# EAGLE design cloud_humidity_sensor_v1 (EAGLE 6.4)
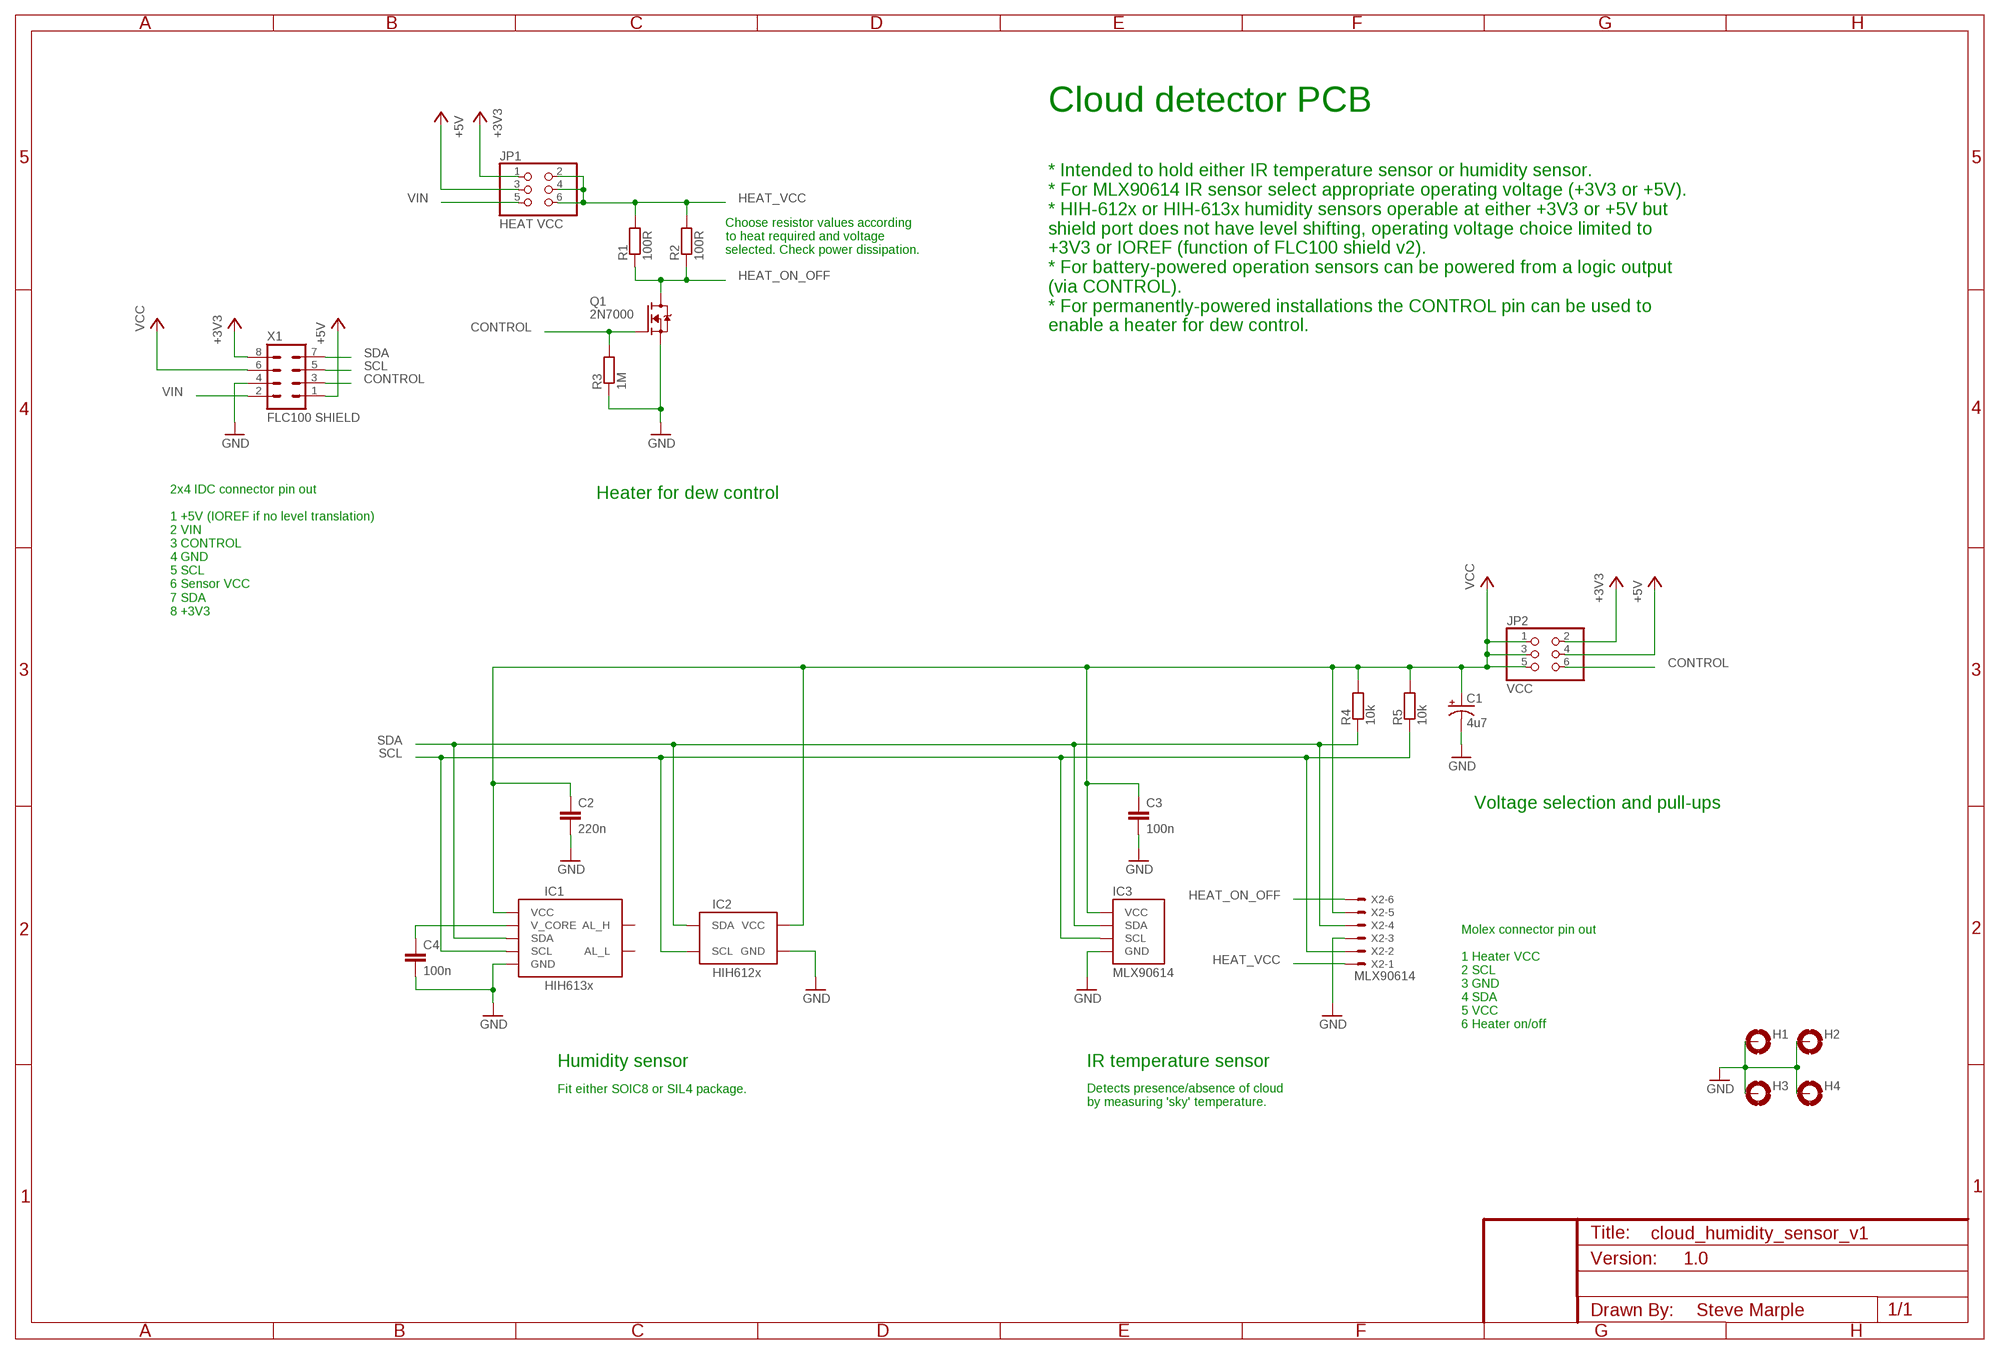
[diagram p0: schematic, sheet 1]
FRAME1 (FRAME-A3): VERSION: 1.0

## Parts
C1  4u7  CAP_POLPTH2  [CPOL-RADIAL-10UF-25V]
C2  220n  CAPPTH  [CAP-PTH-SMALL]
C3  100n  CAPPTH  [CAP-PTH-SMALL]
C4  100n  CAPPTH  [CAP-PTH-SMALL]
H1  MOUNT-PAD-ROUND3.0  [3,0-PAD]
H2  MOUNT-PAD-ROUND3.0  [3,0-PAD]
H3  MOUNT-PAD-ROUND3.0  [3,0-PAD]
H4  MOUNT-PAD-ROUND3.0  [3,0-PAD]
IC1  HIH613x  HONEYWELL-HIH613XSOIC8  [SO08]
IC2  HIH612x  HONEYWELL-HIH612X  [SIL04]
IC3  MLX90614  MLX90614TO-39  [TO39-4]
JP1  HEAT VCC  PINHD-2X3  [2X03]
JP2  VCC  PINHD-2X3  [2X03]
Q1  2N7000  [TO-92]
R1  100R  RESISTOR  [RES-AXIAL-0.4]
R2  100R  RESISTOR  [RES-AXIAL-0.4]
R3  1M  RESISTOR  [RES-AXIAL-0.4]
R4  10k  RESISTOR  [RES-AXIAL-0.4]
R5  10k  RESISTOR  [RES-AXIAL-0.4]
X1  FLC100 SHIELD  ML8  [ML8]
X2  MLX90614  22-23-2061  [22-23-2061]

## Nets
+3V3 [power]: JP1.1 JP2.2 X1.8
+5V [power]: JP1.3 JP2.4 X1.1
CONTROL: JP2.6 Q1.2(G) R3.P$2 X1.3
GND [power]: C1.2(-) C2.2 C3.2 C4.2 H1.B3,0(MOUNT) H2.B3,0(MOUNT) H3.B3,0(MOUNT) H4.B3,0(MOUNT) IC1.2(GND) IC2.2(GND) IC3.4(GND) Q1.1(S) R3.P$1 X1.4 X2.3
HEAT_ON_OFF [power]: Q1.3(D) R1.P$1 R2.P$1 X2.6
HEAT_VCC [power]: JP1.2 JP1.4 JP1.6 R1.P$2 R2.P$2 X2.1
SCL: IC1.3(SCL) IC2.3(SCL) IC3.1(SCL) R5.P$1 X1.5 X2.2
SDA: IC1.4(SDA) IC2.4(SDA) IC3.2(SDA) R4.P$1 X1.7 X2.4
V_CORE [power]: C4.1 IC1.1(V_CORE)
VCC [power]: C1.1(+) C2.1 C3.1 IC1.8(VCC) IC2.1(VCC) IC3.3(VCC) JP2.1 JP2.3 JP2.5 R4.P$2 R5.P$2 X1.6 X2.5
VIN [power]: JP1.5 X1.2
Unconnected: IC1.5(AL_H) IC1.6(AL_L)

## Notes on the sheet
- Cloud detector PCB
- * Intended to hold either IR temperature sensor or humidity sensor.
  * For MLX90614 IR sensor select appropriate operating voltage (+3V3 or +5V).
  * HIH-612x or HIH-613x humidity sensors operable at either +3V3 or +5V but
  shield port does not have level shifting, operating voltage choice limited to
  +3V3 or IOREF (function of FLC100 shield v2).
  * For battery-powered operation sensors can be powered from a logic output
  (via CONTROL).
  * For permanently-powered installations the CONTROL pin can be used to
  enable a heater for dew control.
- Choose resistor values according
  to heat required and voltage
  selected. Check power dissipation.
- Heater for dew control
- 2x4 IDC connector pin out
  
  1 +5V (IOREF if no level translation)
  2 VIN
  3 CONTROL
  4 GND
  5 SCL
  6 Sensor VCC
  7 SDA
  8 +3V3
- Voltage selection and pull-ups
- Molex connector pin out
  
  1 Heater VCC
  2 SCL
  3 GND
  4 SDA
  5 VCC
  6 Heater on/off
- Humidity sensor | IR temperature sensor
- Fit either SOIC8 or SIL4 package.
- Detects presence/absence of cloud
  by measuring 'sky' temperature.
- 1.0
- Steve Marple

## Library data of the parts
C1 = SteveMarple:CAP_POL: Capacitor Polarized These are standard SMD and PTH capacitors. Normally 10uF, 47uF, and 100uF in electrolytic and tantalum varieties. Always verify the external diameter of the through hole cap, it varies with capacity, voltage, and manufacturer. The EIA devices should be standard.
C2-C4 = SparkFun:CAP: Capacitor Standard 0603 ceramic capacitor, and 0.1" leaded capacitor.
H1-H4 = holes:MOUNT-PAD-ROUND: MOUNTING PAD, round
IC1 = SteveMarple:HONEYWELL-HIH613X
IC2 = SteveMarple:HONEYWELL-HIH612X
IC3 = SteveMarple:MLX90614
JP1 JP2 = pinhead:PINHD-2X3: PIN HEADER
Q1 = SteveMarple:2N7000: 2N7000 FET
R1-R5 = SteveMarple:RESISTOR: 1/4W PTH resistor
X1 = SteveMarple:ML8
X2 = con-molex:22-23-2061: .100" (2.54mm) Center Header - 6 Pin; MF: MOLEX; MPN: 22-23-2061; OC_FARNELL: 1462922; OC_NEWARK: 27C1933

## Net classes
1 power: width 0.381 mm

## Board
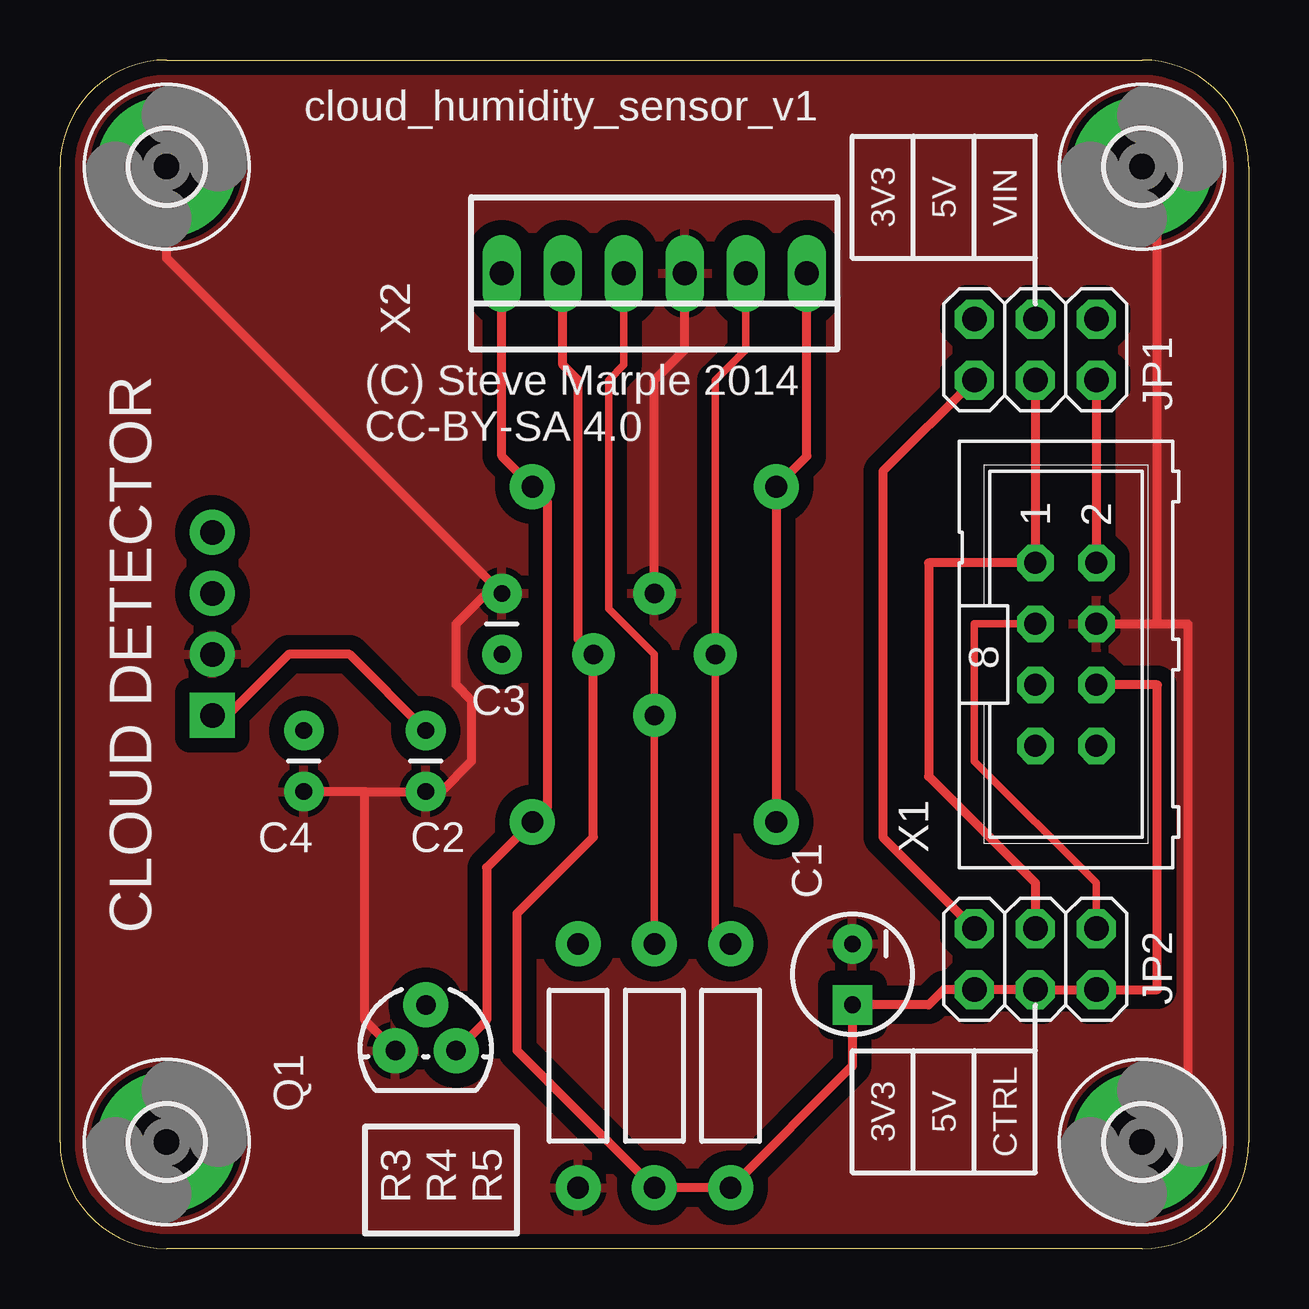
[diagram p1: board, top side]
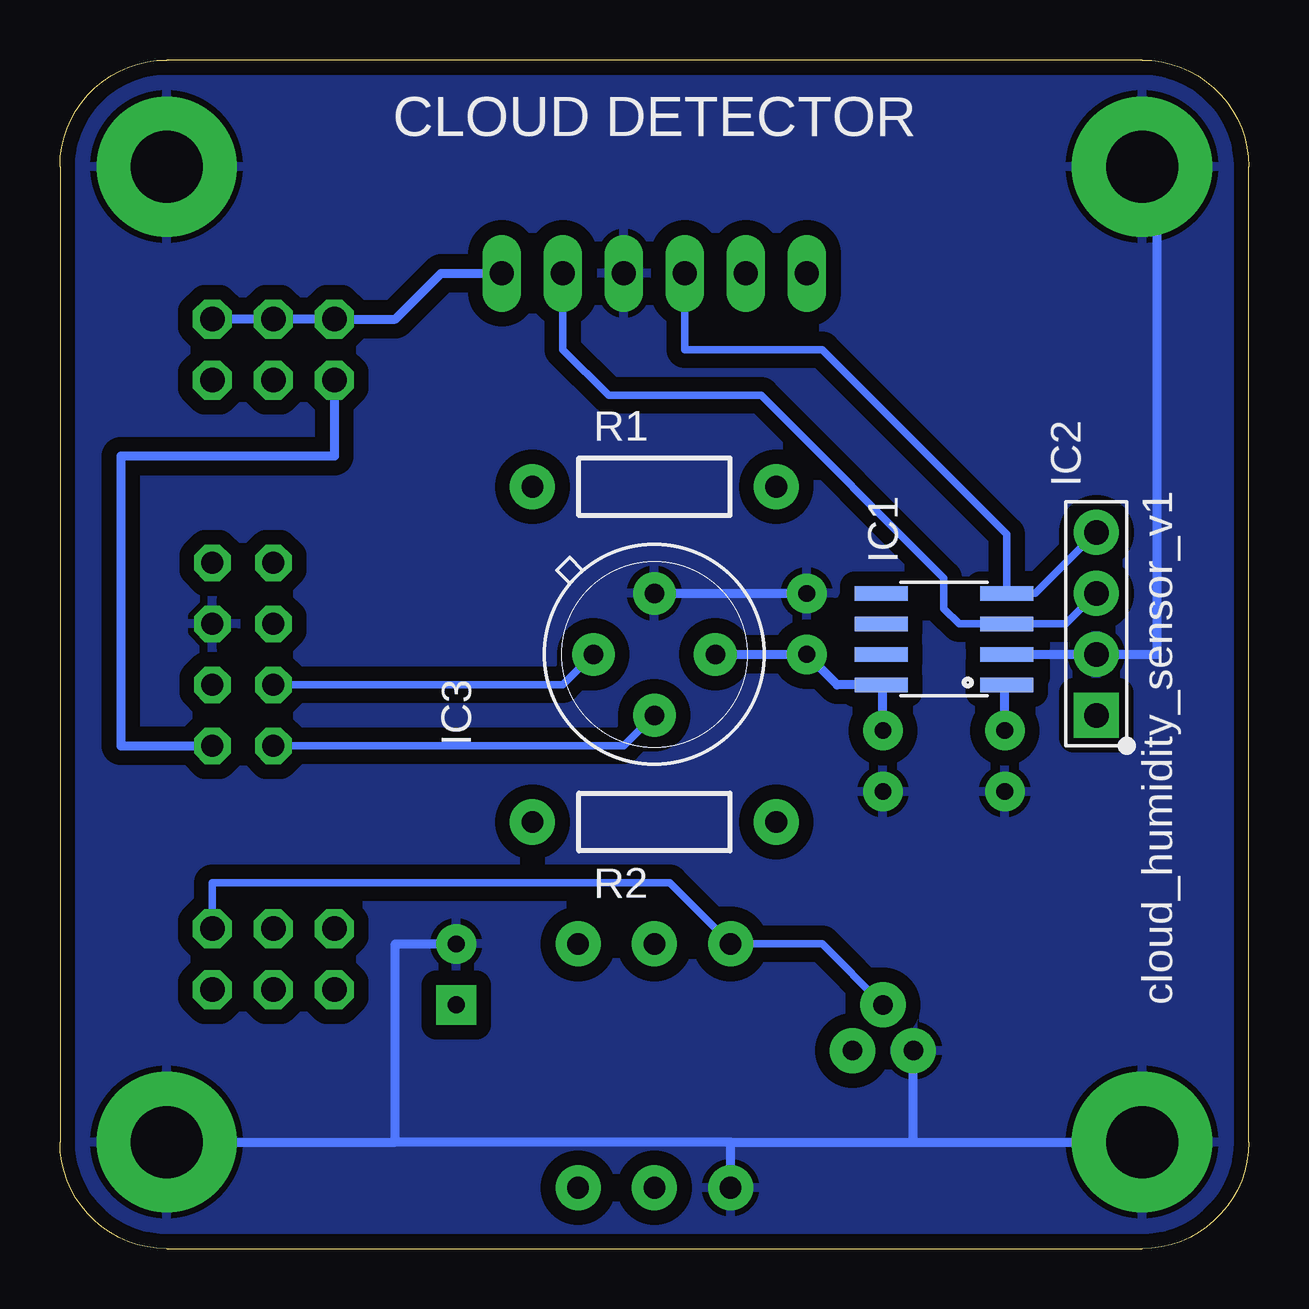
[diagram p2: board, bottom side, seen from below]

Size 49.53 x 49.53 mm. Coordinates in mm from the lower left corner, seen from the top.
Outline: 0,4.45 0,45.09 arc-90 4.45,49.53 45.09,49.53 arc-90 49.53,45.09 49.53,4.45 arc-90 45.09,0 4.45,0 arc-90 0,4.45
Copper layers (1*16): Top 0.035mm / dielectric 1.5mm / Bottom 0.035mm
Design rules "SparkFun_very_conservative": minimum track width 12mil, minimum drill 20mil, track to track 12mil, track to pad 12mil, pad to pad 12mil, via to via 12mil, smd to smd 12mil, copper to edge 10mil, drill to drill 8mil, minimum pad ring 12mil, minimum via ring 12mil, stop-mask expansion 4mil, vias tented up to drill 25mil, thermal gap 10mil
bRestrict: area 8.9,23.8 to 11.2,24.4; area 8.9,26.4 to 11.2,27; area 14.2,26.4 to 16.5,27; area 14.2,23.8 to 16.5,24.4; area 14.2,25.1 to 16.5,25.7; area 8.9,25.1 to 11.2,25.7

### Footprints (pad centres in the part's own frame; a part is rotated, then mirrored left to right if it is on the bottom)
CPOL-RADIAL-10UF-25V = drill 0.7 pad 1.651 square: 1 1.27,0 | drill 0.7 pad 1.651: 2 -1.27,0
CAP-PTH-SMALL = drill 0.7 pad 1.651: 1 0,0; 2 2.54,0
3,0-PAD = drill 3 pad 5.842: B3,0 0,0
SO08 = smd 0.61 x 2.21: 1 -1.905,-2.616; 2 -0.635,-2.616; 3 0.635,-2.616; 4 1.905,-2.616; 5 1.905,2.616; 6 0.635,2.616; 7 -0.635,2.616; 8 -1.905,2.616
SIL04 = drill 1.016 pad 1.88 square: 1 -3.81,0 | drill 1.016 pad 1.88: 2 -1.27,0; 3 1.27,0; 4 3.81,0
TO39-4 = drill 0.813 pad 1.778: 1 0,-2.54; 2 2.54,0; 3 0,2.54; 4 -2.54,0
2X03 = drill 1.016 octagon: 1 -2.54,-1.27; 2 -2.54,1.27; 3 0,-1.27; 4 0,1.27; 5 2.54,-1.27; 6 2.54,1.27
TO-92 = drill 0.813 pad 1.88: 1 -1.27,0; 2 0,1.905; 3 1.27,0
RES-AXIAL-0.4 = drill 0.9 pad 1.88: P$1 -5.08,0; P$2 5.08,0
ML8 = drill 0.914 octagon: 1 -3.81,-1.27; 2 -3.81,1.27; 3 -1.27,-1.27; 4 -1.27,1.27; 5 1.27,-1.27; 6 1.27,1.27; 7 3.81,-1.27; 8 3.81,1.27
22-23-2061 = drill 1 long: 1 -6.35,0; 2 -3.81,0; 3 -1.27,0; 4 1.27,0; 5 3.81,0; 6 6.35,0

### Placement (x,y rotation side)
C1  33.02,11.43 270 top
C2  15.24,21.59 270 top
C3  18.41,24.77 90 top
C4  10.16,21.59 270 top
H1  4.45,4.45 0 top
H2  45.09,4.45 0 top
H3  45.09,45.09 0 top
H4  4.45,45.09 0 top
IC1  12.7,25.4 90 bottom
IC2  6.35,26.04 90 bottom
IC3  24.77,24.77 270 bottom
JP1  40.64,37.47 0 top
JP2  40.64,12.06 0 top
Q1  15.24,8.26 0 top
R1  24.77,31.75 180 bottom
R2  24.77,17.78 180 bottom
R3  21.59,7.62 90 top
R4  24.77,7.62 270 top
R5  27.94,7.62 270 top
X1  41.91,24.77 270 top
X2  24.77,40.64 180 top

### Tracks (layer width: path | path; a pad name or v marks a point on that pad's centre or on a via)
+3V3
  Top 0.381: JP1.1 34.29,32.38 34.29,17.14 JP2.2
  Bottom 0.381: X1.8 46.99,20.95 46.99,33.02 38.1,33.02 JP1.1
+5V
  Top 0.381: JP1.3 X1.1 36.2,28.57 36.2,19.68 40.64,15.24 JP2.4
CONTROL
  Top 0.305: X1.3 38.1,26.04 38.1,20.32 43.18,15.24 JP2.6
  Bottom 0.305: Q1.2 17.78,12.7 R3.P$2 24.13,15.24 43.18,15.24 JP2.6
GND
  Top 0.381: 12.7,19.05 C4.2 | X2.3 26.04,37.47 24.77,36.2 IC3.4 | Q1.1 12.7,9.53 12.7,19.05 | 12.7,19.05 C2.2 15.88,19.05 17.14,20.32 17.14,22.86 16.51,23.5 16.51,26.04 17.78,27.3 C3.2 4.45,41.27 H4.B3,0 | H3.B3,0 45.72,44.45 45.72,26.04 | X1.4 45.72,26.04 | 45.72,26.04 46.99,26.04 46.99,6.35 H2.B3,0
  Bottom 0.381: H2.B3,0 35.56,4.45 | 21.59,4.45 13.97,4.45 | IC3.4 C3.2 | 13.97,4.45 H1.B3,0 | 13.97,4.45 Q1.1 | R3.P$1 21.59,4.45 | 21.59,4.45 35.56,4.45 | 35.56,4.45 35.56,12.7 C1.2 | IC1.2 IC2.2 3.81,24.77 3.81,44.45 H4.B3,0
  pour Bottom (isolate 0.61): -1.27,-1.27 -1.27,50.8 50.8,50.8 50.8,-1.27
  pour Top (isolate 0.61): -2.54,-2.54 -2.54,52.07 52.07,52.07 52.07,-2.54
HEAT_ON_OFF
  Top 0.381: X2.6 18.41,33.02 R1.P$1 20.32,31.11 20.32,18.41 R2.P$1 17.78,15.88 17.78,9.53 Q1.3
HEAT_VCC
  Top 0.381: R2.P$2 R1.P$2 31.11,33.02 X2.1
  Bottom 0.381: X2.1 33.66,40.64 35.56,38.73 JP1.2 JP1.4 JP1.6
SCL
  Top 0.305: X2.2 28.57,37.47 27.3,36.2 IC3.1 27.3,13.34 R5.P$1
  Bottom 0.305: X1.5 28.57,23.5 IC3.1 | X2.2 28.57,37.47 26.67,35.56 20.32,35.56 12.7,27.94 12.7,26.67 12.06,26.04 IC1.3 7.62,26.04 IC2.3
SDA
  Top 0.305: R4.P$1 IC3.2 24.77,24.77 22.86,26.67 22.86,36.2 23.5,36.83 X2.4
  Bottom 0.305: X1.7 26.04,20.95 IC3.2 | X2.4 23.5,37.47 17.78,37.47 10.08,29.77 IC1.4 8.89,27.3 IC2.4
V_CORE
  Bottom 0.381: C4.1 10.16,23.42 IC1.1
VCC
  Top 0.381: X2.5 20.95,36.83 21.59,36.2 21.59,25.4 IC3.3 22.23,17.14 19.05,13.97 19.05,8.26 R4.P$2 R5.P$2 33.02,7.62 C1.1 36.2,10.16 36.83,10.79 JP2.1 JP2.3 JP2.5 45.72,10.79 45.72,23.5 X1.6 | C2.1 12.06,24.77 9.53,24.77 6.99,22.23 IC2.1
  Bottom 0.381: IC3.3 C3.1 17.14,23.5 IC1.8 15.24,23.42 C2.1
VIN
  Top 0.381: JP1.5 X1.2

### Text on the board
_tsilk: 3V3 | 5V | VIN | (C) Steve Marple 2014 / CC-BY-SA 4.0 | CLOUD DETECTOR | 3V3 | 5V | CTRL
_bsilk: CLOUD DETECTOR